# Altium schematic sheet Sheet1.SchDoc
size A4
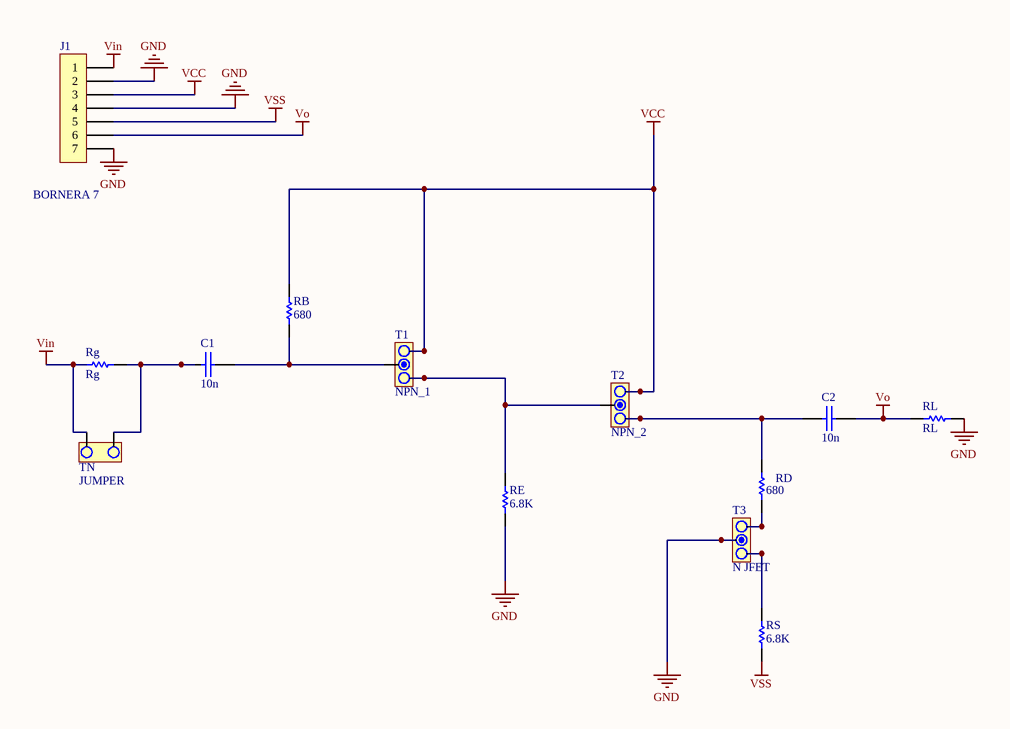
[diagram p0: Sheet1.SchDoc]

## Parts
C1  10n  [0805]
C2  10n  [0805]
J1  BORNERA 7  [BORNERA7]
RB  680  [0805]
RD  680  [0805]
RE  6.8K  [0805]
Rg  Rg  [0805]
RL  RL  [0805]
RS  6.8K  [0805]
T1  NPN_1  [JUMPER3]
T2  NPN_2  [JUMPER3]
T3  N JFET  [JUMPER3]
TN  JUMPER  [JUMPER2]

## Nets
GND: J1.2 J1.4 J1.7 RE.1 RL.2 T3.2
VCC: J1.3 RB.2 T1.1 T2.1
Vin: J1.1 Rg.1 TN.1
Vo: C2.2 J1.6 RL.1
VSS: J1.5 RS.1
NetC1_1: C1.1 Rg.2 TN.2
NetC1_2: C1.2 RB.1 T1.2
NetC2_1: C2.1 RD.2 T2.3
NetRD_1: RD.1 T3.1
NetRE_2: RE.2 T1.3 T2.2
NetRS_2: RS.2 T3.3

## Library data of the parts
C1 C2 = CAP
RB RD RE Rg RL RS = RES
T1-T3 = JUMPER3